# EAGLE schematic SpiderBackBackup (EAGLE 8.3.1)
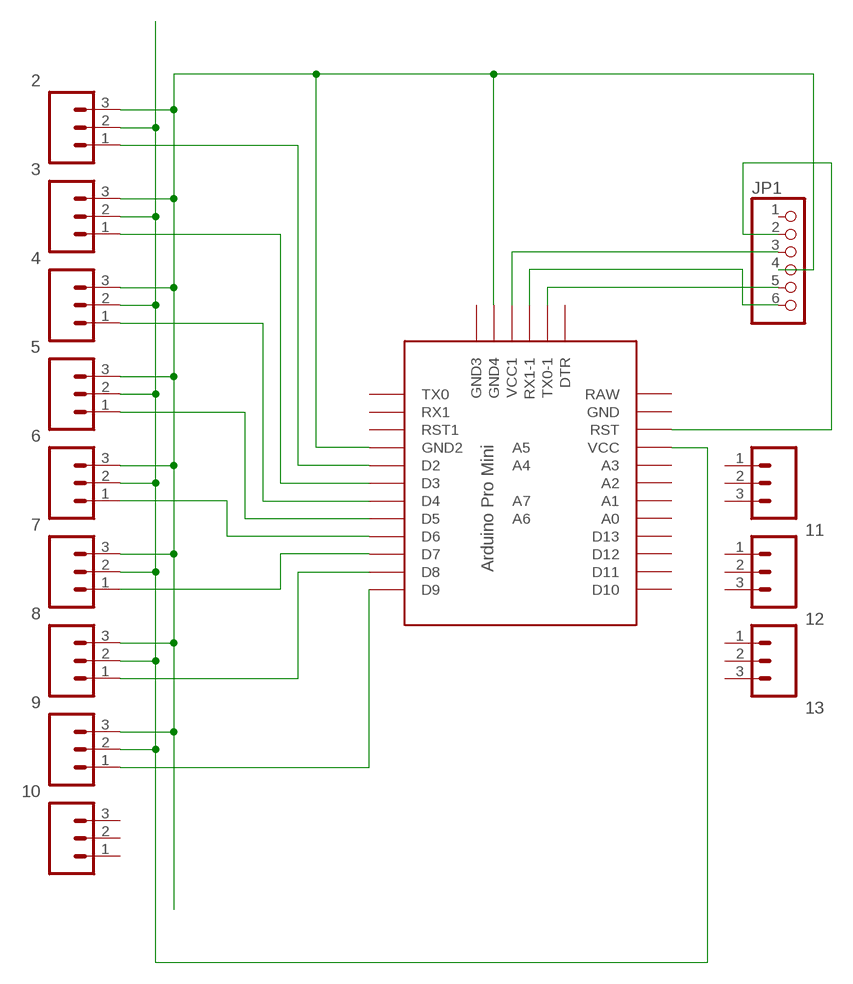
[diagram p0: schematic, sheet 1]

## Parts
2  M03PTH  [1X03]
3  M03PTH  [1X03]
4  M03PTH  [1X03]
5  M03PTH  [1X03]
6  M03PTH  [1X03]
7  M03PTH  [1X03]
8  M03PTH  [1X03]
9  M03PTH  [1X03]
10  M03PTH  [1X03]
11  M03PTH  [1X03]
12  M03PTH  [1X03]
13  M03PTH  [1X03]
JP1  PINHD-1X6CB  [1X06-CLEANBIG]
U$1  PRO-MINI-2  [PRO-MINI-2]

## Nets
N$1: 3.1 U$1.D3
N$2: 2.1 U$1.D2
N$3: 7.1 U$1.D7
N$4: 4.1 U$1.D4
N$5: 5.1 U$1.D5
N$6: 6.1 U$1.D6
N$7: 8.1 U$1.D8
N$8: 9.1 U$1.D9
N$9: JP1.6 U$1.RX1-1
N$10: JP1.5 U$1.TX0-1
N$11: 2.3 3.3 4.3 5.3 6.3 7.3 8.3 9.3 JP1.4 U$1.GND1(GND2) U$1.GND3(GND4)
N$12: JP1.3 U$1.VCC1
N$13: JP1.2 U$1.RST
N$14: 2.2 3.2 4.2 5.2 6.2 7.2 8.2 9.2 U$1.VCC
Unconnected: 10.1 10.2 10.3 11.1 11.2 11.3 12.1 12.2 12.3 13.1 13.2 13.3 JP1.1 U$1.A0 U$1.A1 U$1.A2 U$1.A3 U$1.A4 U$1.A5 U$1.A6 U$1.A7 U$1.D10 U$1.D11 U$1.D12 U$1.D13 U$1.DTR U$1.GND U$1.GND2(GND3) U$1.RAW U$1.RST1 U$1.RX1 U$1.TX0

## Library data of the parts
2-13 = regis_spider_lib:M03: Header 3 Standard 3-pin 0.1" header. Use with straight break away headers (SKU : PRT-00116), right angle break away headers (PRT-00553), swiss pins (PRT-00743), machine pins (PRT-00117), and female headers (PRT-00115). Molex polarized connector foot print use with SKU : PRT-08232 with associated crimp pins and housings.
JP1 = adafruit:PINHD-1X6: PIN HEADER
U$1 = Arduino-clone:PRO-MINI-2: Arduino Pro Mini Layout 2 Sparkfun.com